# Altium schematic sheet AUX_POWER_V3.SchDoc
size A4
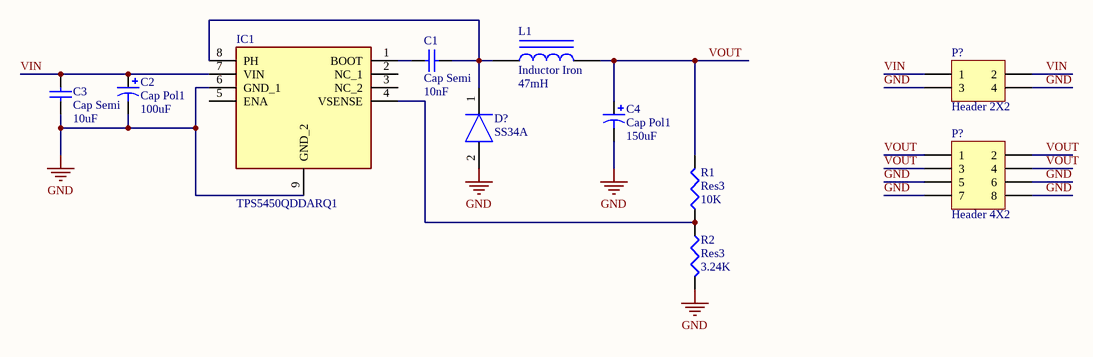
[diagram p0: AUX_POWER_V3.SchDoc]

## Parts
(Parts that share a designator on the sheet are numbered #1, #2 ... from top to bottom, then left to right.)
C1  Cap Semi  value 10nF  [1608[0603]]
C2  Cap Pol1  value 100uF  [CAP-8*10.5]
C3  Cap Semi  value 10uF  [C1206]
C4  Cap Pol1  value 150uF  [CAP-8*10.5]
D?  SS34A  [DIOM5026X262N]
IC1  TPS5450QDDARQ1  [SOIC127P600X170-9N]
L1  Inductor Iron  value 47mH  [CDRH127]
P?#1  Header 2X2  [HDR2X2]
P?#2  Header 4X2  [HDR2X4]
R1  Res3  value 10K  [J1-0603]
R2  Res3  value 3.24K  [J1-0603]

## Nets
GND: C2.2 C3.1 C4.2 D?.2(A) IC1.6(GND_1) IC1.9(GND_2) P?#1.3 P?#1.4 P?#2.5 P?#2.6 P?#2.7 P?#2.8 R2.2
VIN: C2.1 C3.2 IC1.7(VIN) P?#1.1 P?#1.2
VOUT: C4.1 L1.2 P?#2.1 P?#2.2 P?#2.3 P?#2.4 R1.2
NetC1_1: C1.1 IC1.1(BOOT)
NetC1_2: C1.2 D?.1(K) IC1.8(PH) L1.1
NetIC1_4: IC1.4(VSENSE) R1.1 R2.1

Not connected (* = marked no-connect by the designer): IC1 2(NC_1) 3(NC_2) 5(ENA)

## Library data of the parts
C1 C3 = Cap Semi: Capacitor (Semiconductor SIM Model); Published: 8-Jun-2000; LatestRevisionDate: 29-May-2009; LatestRevisionNote: IPC-7351 Footprint Added.; PackageReference: C1206; Publisher: Altium Limited; PackageDescription: Chip Capacitor
C2 C4 = Cap Pol1: Polarized Capacitor (Radial); Published: 8-Jun-2000; LatestRevisionDate: 17-Jul-2002; LatestRevisionNote: Re-released for DXP Platform.; PackageReference: RB7.6-15; Publisher: Altium Limited; PackageDescription: Polarized Capacitor (Radial); 2 Leads
D? = SS34A: Diode; Manufacturer_Name: HY Electronic Corp; Datasheet Link: http://docs-emea.rs-online.com/webdocs/14bb/0900766b814bbf89.pdf; Height: 2.62mm; Manufacturer_Part_Number: SS34A; RS Part Number: 9179196P; RS Price/Stock: http://uk.rs-online.com/web/p/products/9179196P
IC1 = TPS5450QDDARQ1: Integrated Circuit; Manufacturer_Name: Texas Instruments; Datasheet Link: http://www.ti.com/lit/gpn/tps5450-q1; Height: 1.7mm; Manufacturer_Part_Number: TPS5450QDDARQ1; Mouser Part Number: 595-TPS5450QDDARQ1; Mouser Price/Stock: https://www.mouser.com/Search/Refine.aspx?Keyword=595-TPS5450QDDARQ1
L1 = Inductor Iron: Magnetic-Core Inductor; Published: 24-Mar-1999; LatestRevisionDate: 17-Jul-2002; LatestRevisionNote: Re-released for DXP Platform.; PackageReference: AXIAL-0.9; Publisher: Altium Limited; PackageDescription: Axial Device, Thru-Hole; 2 Leads; 0.9 in Pin Spacing
P?#1 = Header 2X2: Header, 2-Pin, Dual row; LatestRevisionDate: 17-Jul-2002; LatestRevisionNote: Re-released for DXP Platform.; Publisher: Altium Limited
P?#2 = Header 4X2: Header, 4-Pin, Dual row; LatestRevisionDate: 17-Jul-2002; LatestRevisionNote: Re-released for DXP Platform.; Publisher: Altium Limited
R1 R2 = Res3: Resistor; Published: 8-Jun-2000; LatestRevisionDate: 29-May-2009; LatestRevisionNote: IPC-7351 Footprint Added.; PackageReference: J1-0603; Publisher: Altium Limited; PackageDescription: Chip Resistor